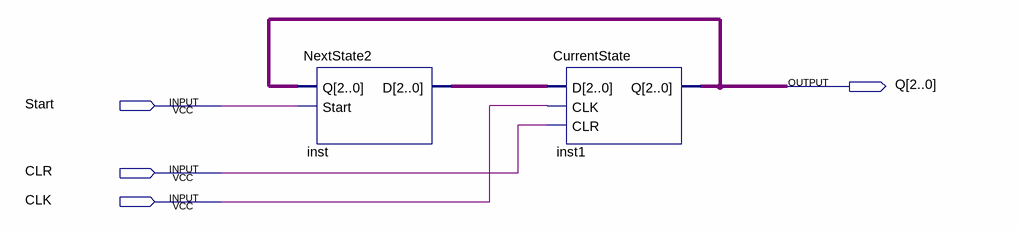
[diagram p0: schematic sheet]
// Quartus schematic Control2.bdf as structural Verilog: 2 symbols, 4 pins
module Control2 (
  input  Start,
  input  CLR,
  input  CLK,
  output [2:0] Q
);

  wire [2:0] inst_d;

  NextState2 inst (.Q(Q), .Start(Start), .D(inst_d));
  CurrentState inst1 (.D(inst_d), .CLK(CLK), .CLR(CLR), .Q(Q));
endmodule
